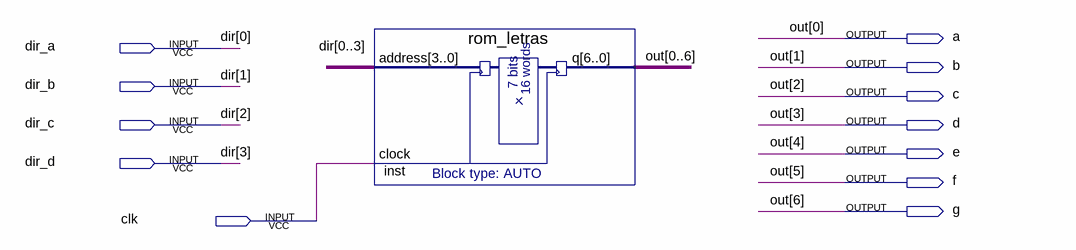
[diagram p0: schematic sheet]
// Quartus schematic bin_a_display.bdf as structural Verilog: 1 symbols, 12 pins
module bin_a_display (
  input  dir_a,
  input  dir_b,
  input  dir_c,
  input  dir_d,
  input  clk,
  output a,
  output b,
  output c,
  output d,
  output e,
  output f,
  output g
);

  rom_letras inst (.address({dir_a, dir_b, dir_c, dir_d}), .clock(clk), .q({a, b, c, d, e, f, g}));

  // Other names for the same wires on the sheet: dir[3:0] = {dir_d, dir_c, dir_b, dir_a};
  //   out[6:0] = {g, f, e, d, c, b, a}
endmodule
